# Altium schematic sheet EqualizerTop.SchDoc
size A4 portrait; DocumentNumber: 2; SheetNumber: 2; SheetTotal: 4
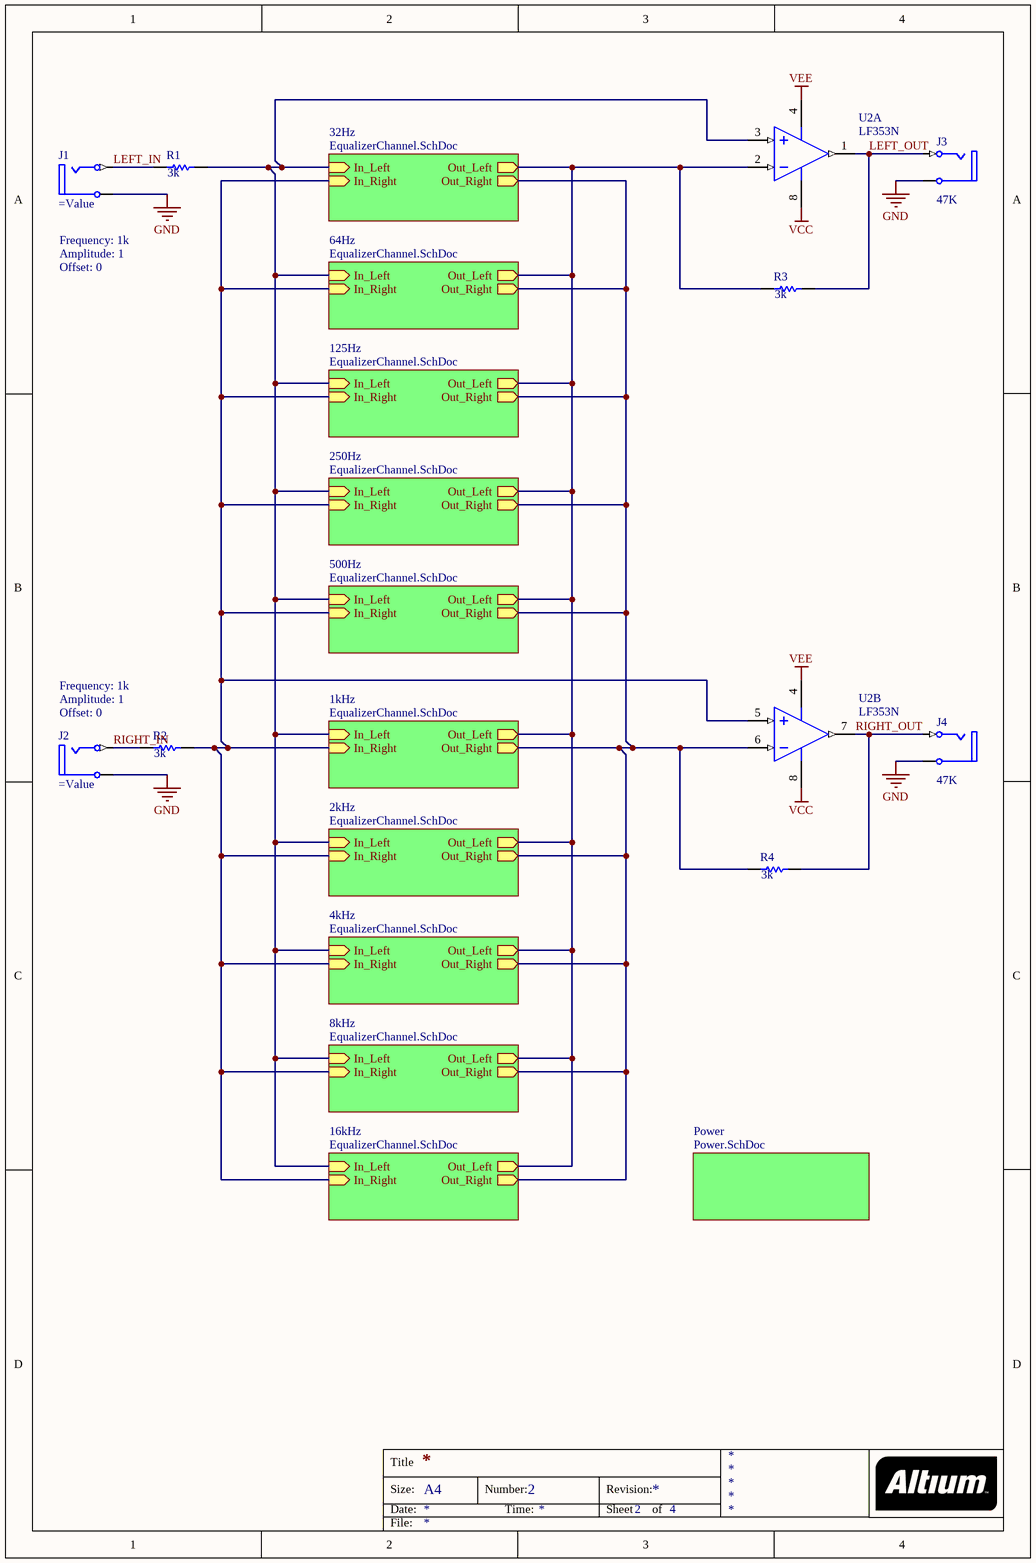
[diagram p0: EqualizerTop.SchDoc]

## Parts
J1  Offset: 0  Amplitude: 1  Frequency: 1k  [RCA/4.5-H2]
J2  Offset: 0  Amplitude: 1  Frequency: 1k  [RCA/4.5-H2]
J3  47K  [RCA/4.5-H2]
J4  47K  [RCA/4.5-H2]
R1  3k  [3216[1206]]
R2  3k  [3216[1206]]
R3  3k  [3216[1206]]
R4  3k  [3216[1206]]
U2  LF353N  [N08E]  (parts A,B of 2)

## Sub-sheets
1kHz = EqualizerChannel.SchDoc: In_Left (in), Out_Left (out), In_Right (in), Out_Right (out)  | C1_Value: 3.9nF; C2_Value: 0.22uF; R1_Value: 68k; R2_Value: 470; POT_SET: {SLIDER_1K}
2kHz = EqualizerChannel.SchDoc: In_Left (in), Out_Left (out), In_Right (in), Out_Right (out)  | C1_Value: 2nF; C2_Value: 0.1uF; R1_Value: 68k; R2_Value: 470; POT_SET: {SLIDER_2K}
4kHz = EqualizerChannel.SchDoc: In_Left (in), Out_Left (out), In_Right (in), Out_Right (out)  | C1_Value: 1.1nF; C2_Value: 0.056uF; R1_Value: 62k; R2_Value: 470; POT_SET: {SLIDER_4K}
8kHz = EqualizerChannel.SchDoc: In_Left (in), Out_Left (out), In_Right (in), Out_Right (out)  | C1_Value: 510pF; C2_Value: 0.022uF; R1_Value: 68k; R2_Value: 510; POT_SET: {SLIDER_8K}
16kHz = EqualizerChannel.SchDoc: In_Left (in), Out_Left (out), In_Right (in), Out_Right (out)  | C1_Value: 330pF; C2_Value: 0.012uF; R1_Value: 51k; R2_Value: 510; POT_SET: {SLIDER_16K}
32Hz = EqualizerChannel.SchDoc: In_Left (in), Out_Left (out), In_Right (in), Out_Right (out)  | C1_Value: 0.12uF; C2_Value: 4.7uF; R1_Value: 75k; R2_Value: 500; POT_SET: {SLIDER_32}
64Hz = EqualizerChannel.SchDoc: In_Left (in), Out_Left (out), In_Right (in), Out_Right (out)  | C1_Value: 0.056uF; C2_Value: 3.3uF; R1_Value: 68k; R2_Value: 510; POT_SET: {SLIDER_64}
125Hz = EqualizerChannel.SchDoc: In_Left (in), Out_Left (out), In_Right (in), Out_Right (out)  | C1_Value: 0.033uF; C2_Value: 1.5uF; R1_Value: 62k; R2_Value: 510; POT_SET: {SLIDER_125}
250Hz = EqualizerChannel.SchDoc: In_Left (in), Out_Left (out), In_Right (in), Out_Right (out)  | C1_Value: 0.015uF; C2_Value: 0.82uF; R1_Value: 68k; R2_Value: 470; POT_SET: {SLIDER_250}
500Hz = EqualizerChannel.SchDoc: In_Left (in), Out_Left (out), In_Right (in), Out_Right (out)  | C1_Value: 8.2nF; C2_Value: 0.39uF; R1_Value: 62k; R2_Value: 470; POT_SET: {SLIDER_500}
Power = Power.SchDoc: no entries

## Nets
GND: J1.1A(Ground) J2.1A(Ground) J3.1A(Ground) J4.1A(Ground)
VCC: U2.8(V+)
VEE: U2.4(V-)
LEFT_IN: J1.2B(Signal) R1.1
LEFT_OUT: J3.2B(Signal) R3.2 U2.1(OUTA)
RIGHT_IN: J2.2B(Signal) R2.1
RIGHT_OUT: J4.2B(Signal) R4.2 U2.7(OUTB)
NetR1_2: R1.2 U2.3(INA+) ; sheet 32Hz/In_Left, sheet 64Hz/In_Left, sheet 125Hz/In_Left, sheet 250Hz/In_Left, sheet 500Hz/In_Left, sheet 1kHz/In_Left, sheet 2kHz/In_Left, sheet 4kHz/In_Left, sheet 8kHz/In_Left, sheet 16kHz/In_Left
NetR2_2: R2.2 U2.5(INB+) ; sheet 32Hz/In_Right, sheet 64Hz/In_Right, sheet 125Hz/In_Right, sheet 250Hz/In_Right, sheet 500Hz/In_Right, sheet 1kHz/In_Right, sheet 2kHz/In_Right, sheet 4kHz/In_Right, sheet 8kHz/In_Right, sheet 16kHz/In_Right
NetR3_1: R3.1 U2.2(INA-) ; sheet 32Hz/Out_Left, sheet 64Hz/Out_Left, sheet 125Hz/Out_Left, sheet 250Hz/Out_Left, sheet 500Hz/Out_Left, sheet 1kHz/Out_Left, sheet 2kHz/Out_Left, sheet 4kHz/Out_Left, sheet 8kHz/Out_Left, sheet 16kHz/Out_Left
NetR4_1: R4.1 U2.6(INB-) ; sheet 32Hz/Out_Right, sheet 64Hz/Out_Right, sheet 125Hz/Out_Right, sheet 250Hz/Out_Right, sheet 500Hz/Out_Right, sheet 1kHz/Out_Right, sheet 2kHz/Out_Right, sheet 4kHz/Out_Right, sheet 8kHz/Out_Right, sheet 16kHz/Out_Right

## Notes on the sheet
- Title
- Size:
- Date:
- A4
- Number:
- Time:
- Revision:
- Sheet
- of
- File:

## Library data of the parts
J1-J4 = RCA: RCA Phono Jack, Right Angle, Thru-Hole, Snap-In; PCB_Layout: Complies with manufacturer's recommendation.; DrillAndSlotSize: Corresponds to nominal value.; Published: 15-Jul-2004; LatestRevisionDate: 15-Jul-2004; LatestRevisionNote: Component Replaced.; DatasheetDocument: 7-Jul-2000; PackageDocument: 7-Jul-2000; PackageReference: 161; Publisher: Altium Limited; ComponentLink1Description: Manufacturer Link; ComponentLink1URL: http://www.mouser.com/kobiconn/
  J3 J4: Value: 47K
R1-R4 = Res1: Resistor; Published: 8-Jun-2000; LatestRevisionDate: 17-Jul-2002; LatestRevisionNote: Re-released for DXP Platform.; Publisher: Altium Limited; Value: 3k
U2 = LF353N: Wide Bandwidth Dual JFET Input Operational Amplifier, 8-pin MDIP; Manufacturer: National Semiconductor; PackageTopMarking: NSUZXYTTE#*LF*353N; PowerWise: N; CompType: Amplifiers; Published: 4-Dec-2008; LatestRevisionDate: 13-Jan-2009; LatestRevisionNote: Sim Model Added.; PackageReference: N08E; Publisher: Altium Limited; ComponentLink1Description: LF353 Datasheet; ComponentLink1URL: http://www.national.com/ds/LF/LF353.pdf; ComponentLink2Description: LF353 Web Page; ComponentLink2URL: http://www.national.com/pf/LF/LF353.html; ComponentLink3Description: N08E Package Page; ComponentLink3URL: http://www.national.com/packaging/folders/n08e.html; DatasheetVersion: Dec-2003; PackageVersion: revG, May-2006; PackageDescription: MDIP, .365 x .250 x .130in, 8 Lead, .100in Pitch; Supplier 1: Farnell; Supplier Part Number 1: 9487034; PartNumber: LF353N; RoHS: N; PinCount: 8; Code_JEDEC: MS-001-BA